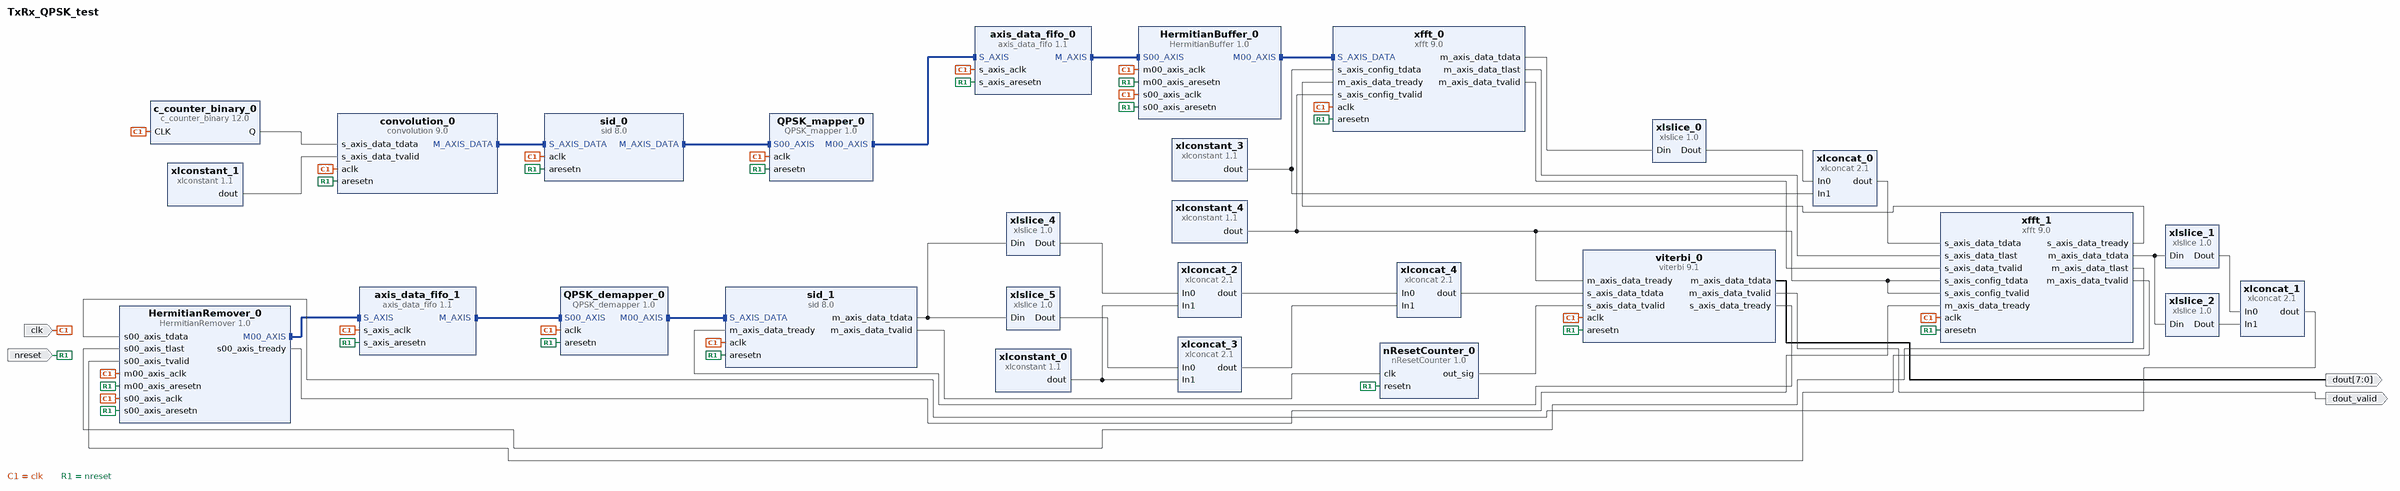
[diagram p0: block diagram of the top level]
# Vivado block design TxRx_QPSK_test, Vivado 2016.2
create_bd_design TxRx_QPSK_test

create_bd_port -dir I -type clk clk
create_bd_port -dir I -type rst nreset
create_bd_port -dir O -from 7 -to 0 dout
create_bd_port -dir O dout_valid

create_bd_cell -type ip -vlnv xilinx.com:ip:c_counter_binary:12.0 c_counter_binary_0
set_property -dict {CONFIG.Output_Width 8} [get_bd_cells c_counter_binary_0]
create_bd_cell -type ip -vlnv xilinx.com:ip:xfft:9.0 xfft_0
set_property -dict [list \
  CONFIG.transform_length 64 \
  CONFIG.implementation_options radix_2_burst_io \
  CONFIG.data_format fixed_point \
  CONFIG.input_width 8 \
  CONFIG.scaling_options unscaled \
  CONFIG.rounding_modes convergent_rounding \
  CONFIG.aresetn true \
  CONFIG.output_ordering natural_order \
  CONFIG.cyclic_prefix_insertion false \
  CONFIG.number_of_stages_using_block_ram_for_data_and_phase_factors 0 \
  CONFIG.complex_mult_type use_mults_performance \
  CONFIG.butterfly_type use_xtremedsp_slices \
] [get_bd_cells xfft_0]
create_bd_cell -type ip -vlnv xilinx.com:ip:xfft:9.0 xfft_1
set_property -dict [list \
  CONFIG.transform_length 64 \
  CONFIG.implementation_options radix_2_burst_io \
  CONFIG.data_format fixed_point \
  CONFIG.input_width 8 \
  CONFIG.scaling_options unscaled \
  CONFIG.rounding_modes convergent_rounding \
  CONFIG.aresetn true \
  CONFIG.output_ordering natural_order \
  CONFIG.cyclic_prefix_insertion false \
  CONFIG.number_of_stages_using_block_ram_for_data_and_phase_factors 0 \
  CONFIG.complex_mult_type use_mults_performance \
  CONFIG.butterfly_type use_xtremedsp_slices \
] [get_bd_cells xfft_1]
create_bd_cell -type ip -vlnv xilinx.com:ip:xlconcat:2.1 xlconcat_0
set_property -dict {CONFIG.IN0_WIDTH 8 CONFIG.IN1_WIDTH 8} [get_bd_cells xlconcat_0]
create_bd_cell -type ip -vlnv xilinx.com:ip:xlconcat:2.1 xlconcat_1
set_property -dict {CONFIG.IN0_WIDTH 8 CONFIG.IN1_WIDTH 8} [get_bd_cells xlconcat_1]
create_bd_cell -type ip -vlnv xilinx.com:ip:xlconstant:1.1 xlconstant_1
set_property -dict {CONFIG.CONST_WIDTH 8} [get_bd_cells xlconstant_1]
create_bd_cell -type ip -vlnv xilinx.com:ip:xlconstant:1.1 xlconstant_3
set_property -dict {CONFIG.CONST_WIDTH 8 CONFIG.CONST_VAL 0} [get_bd_cells xlconstant_3]
create_bd_cell -type ip -vlnv xilinx.com:ip:xlconstant:1.1 xlconstant_4
set_property -dict {CONFIG.CONST_WIDTH 8 CONFIG.CONST_VAL 1} [get_bd_cells xlconstant_4]
create_bd_cell -type ip -vlnv xilinx.com:ip:xlslice:1.0 xlslice_0
set_property -dict {CONFIG.DOUT_WIDTH 8 CONFIG.DIN_FROM 7} [get_bd_cells xlslice_0]
create_bd_cell -type ip -vlnv xilinx.com:ip:xlslice:1.0 xlslice_1
set_property -dict {CONFIG.DOUT_WIDTH 8 CONFIG.DIN_FROM 7} [get_bd_cells xlslice_1]
create_bd_cell -type ip -vlnv xilinx.com:ip:xlslice:1.0 xlslice_2
set_property -dict {CONFIG.DOUT_WIDTH 8 CONFIG.DIN_TO 16 CONFIG.DIN_FROM 23} [get_bd_cells xlslice_2]
create_bd_cell -type ip -vlnv xilinx.com:ip:convolution:9.0 convolution_0
set_property -dict [list \
  CONFIG.Convolution_Code_Radix Octal \
  CONFIG.Convolution_Code0 133 \
  CONFIG.Convolution_Code1 171 \
  CONFIG.Convolution_Code2 003 \
  CONFIG.Convolution_Code3 003 \
  CONFIG.Convolution_Code4 003 \
  CONFIG.Convolution_Code5 003 \
  CONFIG.Convolution_Code6 003 \
] [get_bd_cells convolution_0]
create_bd_cell -type ip -vlnv xilinx.com:ip:viterbi:9.1 viterbi_0
set_property -dict [list \
  CONFIG.Coding Hard_Coding \
  CONFIG.Soft_Width 1 \
  CONFIG.Convolution0_Code0 1011011 \
  CONFIG.Convolution0_Code1 1111001 \
  CONFIG.BER_Symbol_Count false \
] [get_bd_cells viterbi_0]
create_bd_cell -type ip -vlnv xilinx.com:user:nResetCounter:1.0 nResetCounter_0
create_bd_cell -type ip -vlnv xilinx.com:ip:xlconcat:2.1 xlconcat_2
set_property -dict {CONFIG.IN0_WIDTH 1 CONFIG.IN1_WIDTH 7} [get_bd_cells xlconcat_2]
create_bd_cell -type ip -vlnv xilinx.com:ip:xlconcat:2.1 xlconcat_3
set_property -dict {CONFIG.IN0_WIDTH 1 CONFIG.IN1_WIDTH 7} [get_bd_cells xlconcat_3]
create_bd_cell -type ip -vlnv xilinx.com:ip:xlconcat:2.1 xlconcat_4
set_property -dict {CONFIG.IN0_WIDTH 8 CONFIG.IN1_WIDTH 8} [get_bd_cells xlconcat_4]
create_bd_cell -type ip -vlnv xilinx.com:ip:xlslice:1.0 xlslice_4
set_property -dict {CONFIG.DOUT_WIDTH 1 CONFIG.DIN_TO 0 CONFIG.DIN_FROM 0 CONFIG.DIN_WIDTH 8} [get_bd_cells xlslice_4]
create_bd_cell -type ip -vlnv xilinx.com:ip:xlslice:1.0 xlslice_5
set_property -dict {CONFIG.DOUT_WIDTH 1 CONFIG.DIN_TO 1 CONFIG.DIN_FROM 1 CONFIG.DIN_WIDTH 8} [get_bd_cells xlslice_5]
create_bd_cell -type ip -vlnv xilinx.com:ip:xlconstant:1.1 xlconstant_0
set_property -dict {CONFIG.CONST_WIDTH 7 CONFIG.CONST_VAL 0} [get_bd_cells xlconstant_0]
create_bd_cell -type ip -vlnv xilinx.com:ip:sid:8.0 sid_0
set_property -dict [list \
  CONFIG.symbol_width 2 \
  CONFIG.sid_type rectangular \
  CONFIG.number_of_branches 16 \
  CONFIG.number_of_rows_constant_value 28 \
  CONFIG.number_of_columns constant \
  CONFIG.block_size_type rows_columns \
  CONFIG.minimum_rows 15 \
  CONFIG.number_of_columns_constant_value 8 \
  CONFIG.col_port_width 4 \
  CONFIG.minimum_columns 15 \
  CONFIG.block_size_constant_value 217 \
  CONFIG.block_size_port_width 8 \
  CONFIG.HAS_ARESETN true \
  CONFIG.HAS_DOUT_TREADY true \
] [get_bd_cells sid_0]
create_bd_cell -type ip -vlnv xilinx.com:ip:sid:8.0 sid_1
set_property -dict [list \
  CONFIG.symbol_width 2 \
  CONFIG.sid_type rectangular \
  CONFIG.mode deinterleaver \
  CONFIG.number_of_branches 16 \
  CONFIG.number_of_rows_constant_value 28 \
  CONFIG.block_size_type rows_columns \
  CONFIG.minimum_rows 15 \
  CONFIG.number_of_columns_constant_value 8 \
  CONFIG.col_port_width 4 \
  CONFIG.minimum_columns 15 \
  CONFIG.block_size_constant_value 217 \
  CONFIG.block_size_port_width 8 \
  CONFIG.HAS_ARESETN true \
  CONFIG.HAS_DOUT_TREADY true \
] [get_bd_cells sid_1]
create_bd_cell -type ip -vlnv xilinx.com:user:HermitianBuffer:1.0 HermitianBuffer_0
create_bd_cell -type ip -vlnv xilinx.com:ip:axis_data_fifo:1.1 axis_data_fifo_0
set_property -dict {CONFIG.TDATA_NUM_BYTES 2 CONFIG.FIFO_DEPTH 256 CONFIG.HAS_TLAST 1} [get_bd_cells axis_data_fifo_0]
create_bd_cell -type ip -vlnv xilinx.com:user:HermitianRemover:1.0 HermitianRemover_0
create_bd_cell -type ip -vlnv xilinx.com:ip:axis_data_fifo:1.1 axis_data_fifo_1
set_property -dict {CONFIG.TDATA_NUM_BYTES 2 CONFIG.FIFO_DEPTH 256 CONFIG.HAS_TLAST 1} [get_bd_cells axis_data_fifo_1]
create_bd_cell -type ip -vlnv xilinx.com:user:QPSK_mapper:1.0 QPSK_mapper_0
create_bd_cell -type ip -vlnv xilinx.com:user:QPSK_demapper:1.0 QPSK_demapper_0

# ---- connections ----

connect_bd_intf_net [get_bd_intf_pins convolution_0/M_AXIS_DATA] [get_bd_intf_pins sid_0/S_AXIS_DATA]
connect_bd_intf_net [get_bd_intf_pins axis_data_fifo_0/M_AXIS] [get_bd_intf_pins HermitianBuffer_0/S00_AXIS]
connect_bd_intf_net [get_bd_intf_pins HermitianBuffer_0/M00_AXIS] [get_bd_intf_pins xfft_0/S_AXIS_DATA]
connect_bd_intf_net [get_bd_intf_pins HermitianRemover_0/M00_AXIS] [get_bd_intf_pins axis_data_fifo_1/S_AXIS]
connect_bd_intf_net [get_bd_intf_pins sid_0/M_AXIS_DATA] [get_bd_intf_pins QPSK_mapper_0/S00_AXIS]
connect_bd_intf_net [get_bd_intf_pins QPSK_mapper_0/M00_AXIS] [get_bd_intf_pins axis_data_fifo_0/S_AXIS]
connect_bd_intf_net [get_bd_intf_pins axis_data_fifo_1/M_AXIS] [get_bd_intf_pins QPSK_demapper_0/S00_AXIS]
connect_bd_intf_net [get_bd_intf_pins QPSK_demapper_0/M00_AXIS] [get_bd_intf_pins sid_1/S_AXIS_DATA]
connect_bd_net [get_bd_ports clk] \
  [get_bd_pins c_counter_binary_0/CLK] [get_bd_pins xfft_0/aclk] [get_bd_pins xfft_1/aclk] [get_bd_pins convolution_0/aclk] \
  [get_bd_pins viterbi_0/aclk] [get_bd_pins sid_0/aclk] [get_bd_pins sid_1/aclk] \
  [get_bd_pins HermitianBuffer_0/m00_axis_aclk] [get_bd_pins HermitianBuffer_0/s00_axis_aclk] \
  [get_bd_pins axis_data_fifo_0/s_axis_aclk] [get_bd_pins HermitianRemover_0/m00_axis_aclk] \
  [get_bd_pins HermitianRemover_0/s00_axis_aclk] [get_bd_pins axis_data_fifo_1/s_axis_aclk] [get_bd_pins QPSK_mapper_0/aclk] \
  [get_bd_pins QPSK_demapper_0/aclk]
connect_bd_net [get_bd_ports nreset] \
  [get_bd_pins xfft_0/aresetn] [get_bd_pins xfft_1/aresetn] [get_bd_pins convolution_0/aresetn] \
  [get_bd_pins nResetCounter_0/resetn] [get_bd_pins viterbi_0/aresetn] [get_bd_pins sid_0/aresetn] \
  [get_bd_pins sid_1/aresetn] [get_bd_pins HermitianBuffer_0/m00_axis_aresetn] \
  [get_bd_pins HermitianBuffer_0/s00_axis_aresetn] [get_bd_pins axis_data_fifo_0/s_axis_aresetn] \
  [get_bd_pins HermitianRemover_0/m00_axis_aresetn] [get_bd_pins HermitianRemover_0/s00_axis_aresetn] \
  [get_bd_pins axis_data_fifo_1/s_axis_aresetn] [get_bd_pins QPSK_mapper_0/aresetn] [get_bd_pins QPSK_demapper_0/aresetn]
connect_bd_net [get_bd_pins xfft_0/m_axis_data_tdata] [get_bd_pins xlslice_0/Din]
connect_bd_net [get_bd_pins xfft_1/m_axis_data_tdata] [get_bd_pins xlslice_1/Din] [get_bd_pins xlslice_2/Din]
connect_bd_net [get_bd_pins xlconcat_0/dout] [get_bd_pins xfft_1/s_axis_data_tdata]
connect_bd_net [get_bd_pins xlconstant_3/dout] [get_bd_pins xfft_0/s_axis_config_tdata] [get_bd_pins xlconcat_0/In1]
connect_bd_net [get_bd_pins xlconstant_4/dout] \
  [get_bd_pins xfft_1/s_axis_config_tdata] [get_bd_pins viterbi_0/m_axis_data_tready] \
  [get_bd_pins xfft_1/s_axis_config_tvalid] [get_bd_pins xfft_0/s_axis_config_tvalid]
connect_bd_net [get_bd_pins xlslice_1/Dout] [get_bd_pins xlconcat_1/In0]
connect_bd_net [get_bd_pins xlslice_2/Dout] [get_bd_pins xlconcat_1/In1]
connect_bd_net [get_bd_pins xlslice_0/Dout] [get_bd_pins xlconcat_0/In0]
connect_bd_net [get_bd_pins xfft_0/m_axis_data_tlast] [get_bd_pins xfft_1/s_axis_data_tlast]
connect_bd_net [get_bd_pins xfft_1/s_axis_data_tready] [get_bd_pins xfft_0/m_axis_data_tready]
connect_bd_net [get_bd_pins xfft_0/m_axis_data_tvalid] [get_bd_pins xfft_1/s_axis_data_tvalid]
connect_bd_net [get_bd_pins xlconcat_2/dout] [get_bd_pins xlconcat_4/In0]
connect_bd_net [get_bd_pins xlconcat_3/dout] [get_bd_pins xlconcat_4/In1]
connect_bd_net -net xlconstant_2_dout [get_bd_pins xlconstant_0/dout] [get_bd_pins xlconcat_2/In1] [get_bd_pins xlconcat_3/In1]
connect_bd_net -net xlslice_3_Dout1 [get_bd_pins xlslice_4/Dout] [get_bd_pins xlconcat_2/In0]
connect_bd_net -net xlslice_4_Dout [get_bd_pins xlslice_5/Dout] [get_bd_pins xlconcat_3/In0]
connect_bd_net [get_bd_pins xlconcat_4/dout] [get_bd_pins viterbi_0/s_axis_data_tdata]
connect_bd_net [get_bd_pins nResetCounter_0/out_sig] [get_bd_pins viterbi_0/s_axis_data_tvalid]
connect_bd_net [get_bd_pins sid_1/m_axis_data_tdata] [get_bd_pins xlslice_4/Din] [get_bd_pins xlslice_5/Din]
connect_bd_net [get_bd_pins c_counter_binary_0/Q] [get_bd_pins convolution_0/s_axis_data_tdata]
connect_bd_net [get_bd_pins xlconstant_1/dout] [get_bd_pins convolution_0/s_axis_data_tvalid]
connect_bd_net [get_bd_pins sid_1/m_axis_data_tvalid] [get_bd_pins nResetCounter_0/clk]
connect_bd_net [get_bd_pins viterbi_0/s_axis_data_tready] [get_bd_pins sid_1/m_axis_data_tready]
connect_bd_net [get_bd_pins viterbi_0/m_axis_data_tdata] [get_bd_ports dout]
connect_bd_net [get_bd_pins viterbi_0/m_axis_data_tvalid] [get_bd_ports dout_valid]
connect_bd_net [get_bd_pins xlconcat_1/dout] [get_bd_pins HermitianRemover_0/s00_axis_tdata]
connect_bd_net [get_bd_pins xfft_1/m_axis_data_tlast] [get_bd_pins HermitianRemover_0/s00_axis_tlast]
connect_bd_net [get_bd_pins xfft_1/m_axis_data_tvalid] [get_bd_pins HermitianRemover_0/s00_axis_tvalid]
connect_bd_net [get_bd_pins HermitianRemover_0/s00_axis_tready] [get_bd_pins xfft_1/m_axis_data_tready]

validate_bd_design
save_bd_design
